# Altium schematic sheet Sheet_1_2024-01-05.schdoc
size 313 x 218 mm
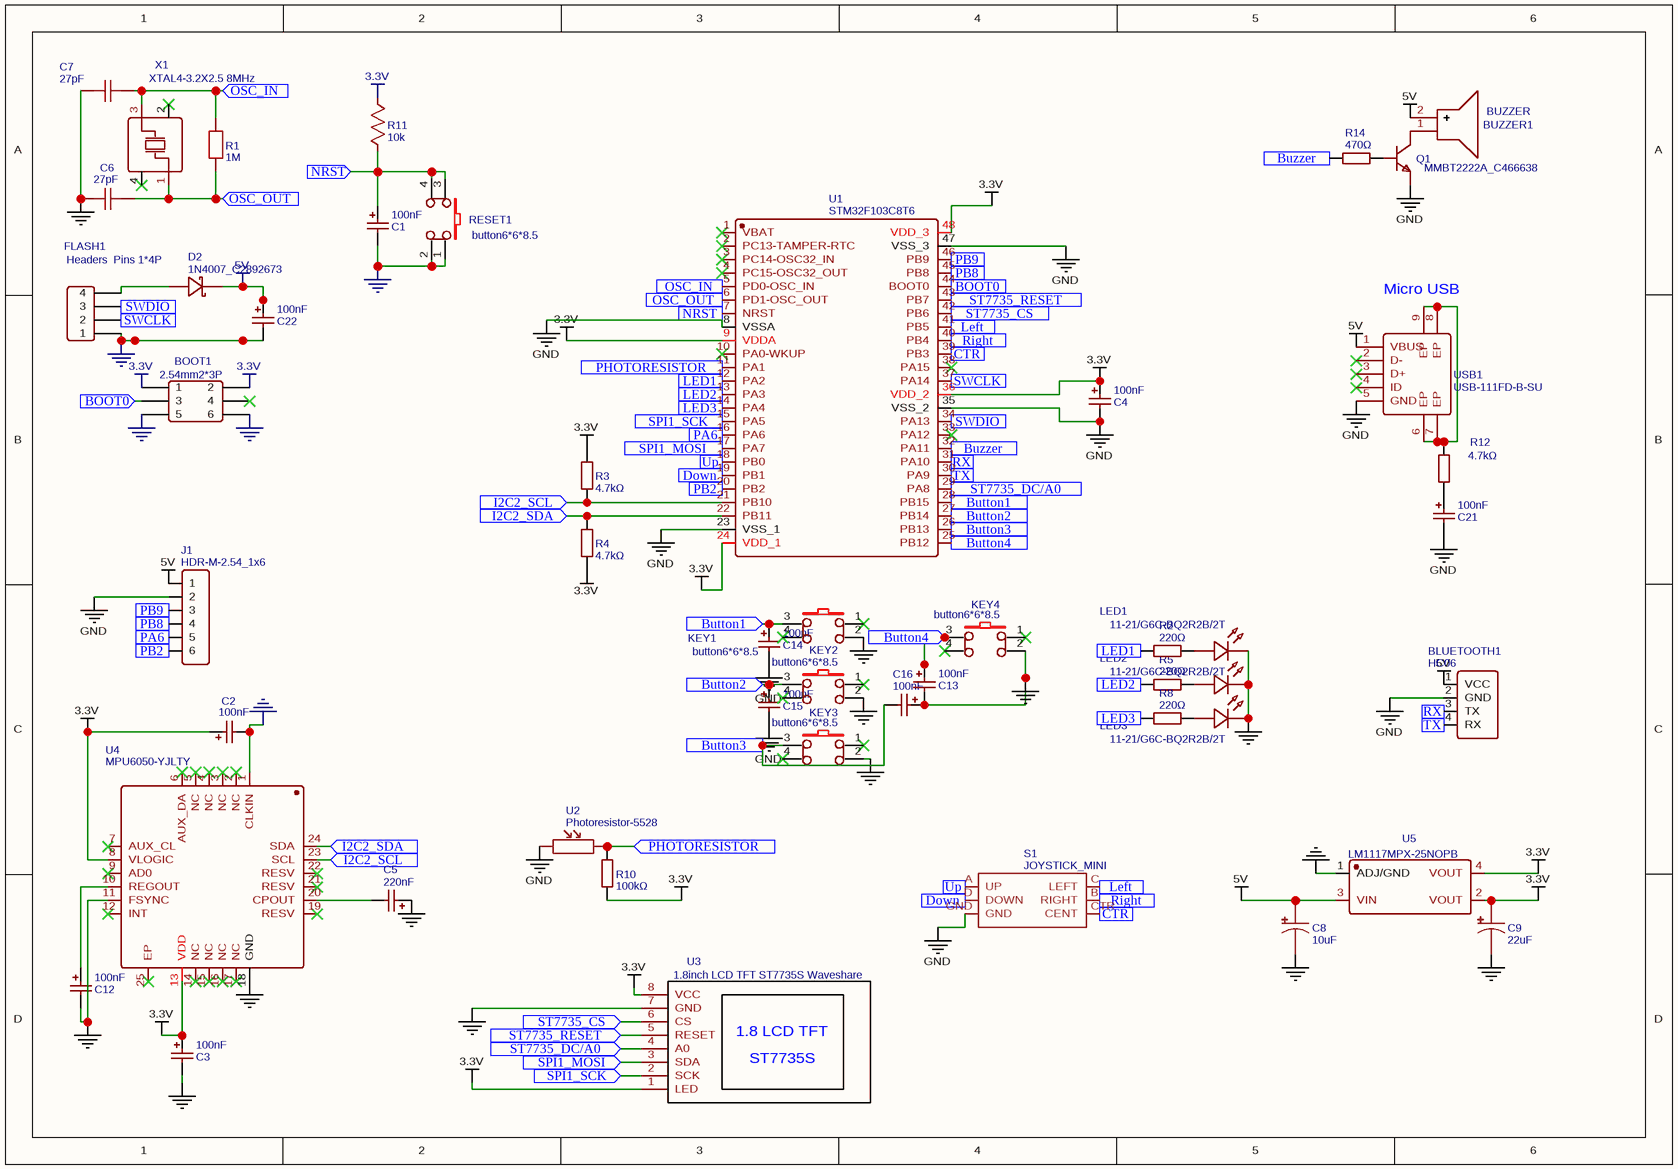
[diagram p0: Sheet_1_2024-01-05.schdoc]

## Parts
BLUETOOTH1  HC06  [HC06]
BOOT1  2.54mm2*3P  [HDR-3X2/2.54]
BUZZER1  BUZZER  [BUZ-TH_BD12.0-P6.00-D0.9-RD]
C1  100nF  [C0402]
C2  100nF  [C0402]
C3  100nF  [C0402]
C4  100nF  [C0402]
C5  220nF  [C0402]
C6  27pF  [C0402]
C7  27pF  [C0402]
C8  10uF  [C0402]
C9  22uF  [C0402]
C12  100nF  [C0402]
C13  100nF  [C0402]
C14  100nF  [C0402]
C15  100nF  [C0402]
C16  100nF  [C0402]
C21  100nF  [C0402]
C22  100nF  [C0402]
D2  1N4007_C2892673  [SMA_L4.3-W2.6-LS5.1-R-RD]
FLASH1  Headers  Pins 1*4P  [HDR-4X1/2.54]
J1  HDR-M-2.54_1x6  [HDR-M-2.54_1X6]
KEY1  button6*6*8.5  [KEY-TH_4P-L6.0-W6.0-P4.50]
KEY2  button6*6*8.5  [KEY-TH_4P-L6.0-W6.0-P4.50]
KEY3  button6*6*8.5  [KEY-TH_4P-L6.0-W6.0-P4.50]
KEY4  button6*6*8.5  [KEY-TH_4P-L6.0-W6.0-P4.50]
LED1  11-21/G6C-BQ2R2B/2T  [LED1206-RD]
LED2  11-21/G6C-BQ2R2B/2T  [LED1206-RD]
LED3  11-21/G6C-BQ2R2B/2T  [LED1206-RD]
Q1  MMBT2222A_C466638  [SOT-23-3_L2.9-W1.4-P1.90-LS2.6-BR]
R1  1M  [R0603]
R2  220Ω  [R1206]
R3  4.7kΩ  [R1206]
R4  4.7kΩ  [R1206]
R5  220Ω  [R1206]
R8  220Ω  [R1206]
R10  100kΩ  [R1206]
R11  10k  [1206]
R12  4.7kΩ  [R1206]
R14  470Ω  [R1206]
RESET1  button6*6*8.5  [KEY-TH_4P-L6.0-W6.0-P4.50]
S1  JOYSTICK_MINI  [JOYSTICK_MINI]
U1  STM32F103C8T6  [LQFP-48_L7.0-W7.0-P0.50-LS9.0-BL]
U2  Photoresistor-5528  [SNR2-3.0]
U3  1.8inch LCD TFT ST7735S Waveshare  [1.8 LCD TFT ST7735S WAVESHARE]
U4  MPU6050-YJLTY  [QFN-24_L4.0-W4.0-P0.50-BL-EP2.7]
U5  LM1117MPX-25NOPB  [SOT-223_L6.5-W3.5-P2.30-LS7.0-BR]
USB1  USB-111FD-B-SU  [USB-SMD_USB-111FD-B-SU]
X1  XTAL4-3.2X2.5 8MHz  [CRYSTAL-SMD_4P-L3.2-W2.5-BL]

## Ports
BOOT0 (in), Button1 (in), Button2 (in), Button3 (in), Button4 (in), Buzzer (in), CTR (in), Down (in), I2C2_SCL (in), I2C2_SDA (in), LED1 (in), LED2 (in), LED3 (in), Left (in), NRST (in), OSC_IN (in), OSC_OUT (in), PA6 (in), PB2 (in), PB8 (in), PB9 (in), PHOTORESISTOR (in), Right (in), RX (in), SPI1_MOSI (in), SPI1_SCK (in), ST7735_CS (in), ST7735_DC/A0 (in), ST7735_RESET (in), SWCLK (in), SWDIO (in), TX (in), Up (in)

## Nets
3.3V: BOOT1.1 BOOT1.2 C2.1 C3.1 C4.1 C9.1 R3.2 R4.2 R10.1 R11.2 U1.9(VDDA) U1.24(VDD_1) U1.36(VDD_2) U1.48(VDD_3) U3.1(LED) U3.8(VCC) U4.8(VLOGIC) U4.13(VDD) U5.2(VOUT) U5.4(VOUT)
5V: BLUETOOTH1.1(VCC) BUZZER1.2(+) C8.1 C22.1 D2.2(K) J1.1 U5.3(VIN) USB1.1(VBUS)
GND: BLUETOOTH1.2(GND) BOOT1.5 BOOT1.6 C1.2 C2.2 C3.2 C4.2 C5.1 C6.1 C7.1 C8.2 C9.2 C12.2 C13.2 C14.2 C15.2 C16.1 C21.2 C22.2 FLASH1.1 J1.2 KEY1.2 KEY2.2 KEY3.2 KEY4.2 LED1.1(K) LED2.1(K) LED3.1(K) Q1.2(E) RESET1.1 RESET1.2 S1.GND U1.8(VSSA) U1.23(VSS_1) U1.35(VSS_2) U1.47(VSS_3) U2.1(P$1) U3.7(GND) U4.1(CLKIN) U4.11(FSYNC) U4.18(GND) U5.1(ADJ/GND) USB1.5(GND)
BOOT0: BOOT1.3 U1.44(BOOT0) ; port BOOT0
Button1: C14.1 KEY1.3 U1.28(PB15) ; port Button1
Button2: C15.1 KEY2.3 U1.27(PB14) ; port Button2
Button3: C16.2 KEY3.3 U1.26(PB13) ; port Button3
Button4: C13.1 KEY4.3 U1.25(PB12) ; port Button4
Buzzer: R14.2 U1.32(PA11) ; port Buzzer
CTR: S1.CTR(CENT) U1.39(PB3) ; port CTR
Down: S1.D(DOWN) U1.19(PB1) ; port Down
I2C2_SCL: R3.1 U1.21(PB10) U4.23(SCL) ; port I2C2_SCL
I2C2_SDA: R4.1 U1.22(PB11) U4.24(SDA) ; port I2C2_SDA
LED1: R2.1 U1.12(PA2) ; port LED1
LED2: R5.1 U1.13(PA3) ; port LED2
LED3: R8.1 U1.14(PA4) ; port LED3
Left: S1.C(LEFT) U1.41(PB5) ; port Left
NRST: C1.1 R11.1 RESET1.3 RESET1.4 U1.7(NRST) ; port NRST
OSC_IN: C7.2 R1.1 U1.5(PD0-OSC_IN) X1.3(OSC2) ; port OSC_IN
OSC_OUT: C6.2 R1.2 U1.6(PD1-OSC_OUT) X1.1(OSC1) ; port OSC_OUT
PA6: J1.5 U1.16(PA6) ; port PA6
PB2: J1.6 U1.20(PB2) ; port PB2
PB8: J1.4 U1.45(PB8) ; port PB8
PB9: J1.3 U1.46(PB9) ; port PB9
PHOTORESISTOR: R10.2 U1.11(PA1) U2.2(P$2) ; port PHOTORESISTOR
Right: S1.B(RIGHT) U1.40(PB4) ; port Right
RX: BLUETOOTH1.3(TX) U1.31(PA10) ; port RX
SPI1_MOSI: U1.17(PA7) U3.3(SDA) ; port SPI1_MOSI
SPI1_SCK: U1.15(PA5) U3.2(SCK) ; port SPI1_SCK
ST7735_CS: U1.42(PB6) U3.6(CS) ; port ST7735_CS
ST7735_DC/A0: U1.29(PA8) U3.4(A0) ; port ST7735_DC/A0
ST7735_RESET: U1.43(PB7) U3.5(RESET) ; port ST7735_RESET
SWCLK: FLASH1.2 U1.37(PA14) ; port SWCLK
SWDIO: FLASH1.3 U1.34(PA13) ; port SWDIO
TX: BLUETOOTH1.4(RX) U1.30(PA9) ; port TX
Up: S1.A(UP) U1.18(PB0) ; port Up
NetBUZZER1_1: BUZZER1.1(-) Q1.3(C)
NetC5_2: C5.2 U4.20(CPOUT)
NetC12_1: C12.1 U4.10(REGOUT)
NetC21_1: C21.1 R12.2
NetD2_1: D2.1(A) FLASH1.4
NetLED1_2: LED1.2(A) R2.2
NetLED2_2: LED2.2(A) R5.2
NetLED3_2: LED3.2(A) R8.2
NetQ1_1: Q1.1(B) R14.1
NetR12_1: R12.1 USB1.6(EP) USB1.7(EP) USB1.8(EP) USB1.9(EP)

Not connected (* = marked no-connect by the designer): BOOT1 4*; KEY1 1* 4*; KEY2 1* 4*; KEY3 1* 4*; KEY4 1* 4*; U1 1(VBAT)* 2(PC13-TAMPER-RTC)* 3(PC14-OSC32_IN)* 4(PC15-OSC32_OUT)* 10(PA0-WKUP)* 33(PA12)* 38(PA15)*; U4 2(NC)* 3(NC)* 4(NC)* 5(NC)* 6(AUX_DA)* 7(AUX_CL)* 9(AD0)* 12(INT)* 14(NC)* 15(NC)* 16(NC)* 17(NC)* 19(RESV)* 21(RESV)* 22(RESV)* 25(EP)*; USB1 2(D-)* 3(D+)* 4(ID)*; X1 2* 4*

## Notes on the sheet
- (near USB1) Micro USB
- (in symbol 1.8inch LCD TFT ST7735S Waveshare) 1.8 LCD TFT; ST7735S

## Library data of the parts
BLUETOOTH1 = HC06: Contributor: Zelevar; timeStamp: 1473620610; BOM_Supplier: LCSC; spicePre: B; spiceSymbolName: HC06
BOOT1 = 2.54mm2*3P: BOM_Manufacturer: BOOMELE; BOM_Manufacturer Part: 2.54mm2*3P直排针袋装环保; BOM_Supplier: LCSC; spicePre: P; BOM_Supplier Part: C65114
BUZZER1 = BUZZER: BOM_Manufacturer: null; Contributor: lcsc; BOM_Supplier: LCSC; BOM_Supplier Part: C9900014030; BOM_Manufacturer Part: buzzer; BOM_JLCPCB Part Class: Extended Part; spicePre: B; spiceSymbolName: BUZZER
C1-C4 C12-C16 C21 C22 = 100nF: BOM_Manufacturer: Kyocera AVX; BOM_Manufacturer Part: TAJA104K035RNJ; nameAlias: Capacitance; BOM_Supplier: LCSC; BOM_Supplier Part: C7173; BOM_JLCPCB Part Class: Extended Part; spicePre: C; spiceSymbolName: TAJA104K035RNJ
C5 = 220nF: BOM_Manufacturer: Kyocera AVX; BOM_Manufacturer Part: TAJA224K035RNJ; nameAlias: Capacitance; BOM_Supplier: LCSC; BOM_Supplier Part: C11364; BOM_JLCPCB Part Class: Extended Part; spicePre: C; spiceSymbolName: TAJA224K035RNJ
C6 C7 = 27pF: nameAlias: Value(F); Contributor: LCEDA_Lib; spicePre: C; spiceSymbolName: C_0402_US
C8 = 10uF: BOM_Manufacturer: Changzhou Huawei Elec; BOM_Manufacturer Part: VT1H0R1MB054000CE0; nameAlias: Capacitance; Contributor: LCSC; BOM_Supplier: LCSC; BOM_Supplier Part: C271438; BOM_JLCPCB Part Class: Extended Part; spicePre: C; spiceSymbolName: VT1H0R1MB054000CE0
C9 = 22uF: BOM_Manufacturer: Changzhou Huawei Elec; BOM_Manufacturer Part: VT1H0R1MB054000CE0; nameAlias: Capacitance; Contributor: LCSC; BOM_Supplier: LCSC; BOM_Supplier Part: C271438; BOM_JLCPCB Part Class: Extended Part; spicePre: C; spiceSymbolName: VT1H0R1MB054000CE0
D2 = 1N4007_C2892673: BOM_Manufacturer: YONGYUTAI(永裕泰); BOM_Manufacturer Part: 1N4007; Contributor: LCSC; BOM_Supplier: LCSC; BOM_Supplier Part: C2892673; BOM_JLCPCB Part Class: Extended Part; spicePre: D; spiceSymbolName: 1N4007_C2892673
FLASH1 = Headers  Pins 1*4P: BOM_Manufacturer: ReliaPro; BOM_Supplier: LCSC; BOM_Manufacturer Part: Headers  Pins 1*4P; image: http://image.lceda.cn/szlcsc/C59481.jpg; spicePre: P
J1 = HDR-M-2.54_1x6: Contributor: LCEDA_Lib; BOM_Supplier Part: C190819; BOM_Supplier: LCSC; spicePre: J; spiceSymbolName: HDR-M-2.54_1x6
KEY1-KEY4 RESET1 = button6*6*8.5: BOM_Manufacturer: ReliaPro; BOM_Supplier Part: C59980; BOM_Supplier: LCSC; BOM_Manufacturer Part: button6*6*8.5; spicePre: K; spiceSymbolName: button6*6*8.5
LED1-LED3 = 11-21/G6C-BQ2R2B/2T: BOM_Manufacturer: null; Contributor: lcsc; BOM_Supplier: LCSC; BOM_Supplier Part: C9900016674; BOM_Manufacturer Part: 11-21/G6C-BQ2R2B/2T; link: https://atta.szlcsc.comnull; BOM_JLCPCB Part Class: Extended Part; spicePre: L; spiceSymbolName: 11-21/G6C-BQ2R2B/2T
Q1 = MMBT2222A_C466638: BOM_Manufacturer: High Diode(海德); Contributor: LCSC; BOM_Supplier: LCSC; BOM_Supplier Part: C466638; BOM_Manufacturer Part: MMBT2222A; BOM_JLCPCB Part Class: Extended Part; spicePre: Q; spiceSymbolName: MMBT2222A_C466638
R1 = 1M: nameAlias: Value(Ω); Contributor: LCEDA_Lib; spicePre: R; spiceSymbolName: R_0603_EU
R2 R5 R8 = 220Ω: BOM_Manufacturer: RALEC(旺诠); BOM_Manufacturer Part: RTT06472JTP; nameAlias: Resistance; Resistance (Ohms): 4.7K; BOM_Supplier: LCSC; BOM_Supplier Part: C104821; BOM_JLCPCB Part Class: Extended Part; spicePre: R; spiceSymbolName: RTT06472JTP
R3 R4 R12 = 4.7kΩ: BOM_Manufacturer: RALEC(旺诠); BOM_Manufacturer Part: RTT06472JTP; nameAlias: Resistance; Resistance (Ohms): 4.7K; BOM_Supplier: LCSC; BOM_Supplier Part: C104821; BOM_JLCPCB Part Class: Extended Part; spicePre: R; spiceSymbolName: RTT06472JTP
R10 = 100kΩ: BOM_Manufacturer: RALEC(旺诠); BOM_Manufacturer Part: RTT06472JTP; nameAlias: Resistance; Resistance (Ohms): 4.7K; BOM_Supplier: LCSC; BOM_Supplier Part: C104821; BOM_JLCPCB Part Class: Extended Part; spicePre: R; spiceSymbolName: RTT06472JTP
R11 = 10k: nameAlias: Value(Ω); BOM_Manufacturer Part: ?; spicePre: R; spiceSymbolName: Res_1206(1/4W)_US
R14 = 470Ω: BOM_Manufacturer: RALEC(旺诠); BOM_Manufacturer Part: RTT06472JTP; nameAlias: Resistance; Resistance (Ohms): 4.7K; BOM_Supplier: LCSC; BOM_Supplier Part: C104821; BOM_JLCPCB Part Class: Extended Part; spicePre: R; spiceSymbolName: RTT06472JTP
S1 = JOYSTICK_MINI: description: Small 5-way tactile joystick, COM-10063; Contributor: SparkFun; spicePre: S; spiceSymbolName: JOYSTICK_MINI
U1 = STM32F103C8T6: BOM_Manufacturer: ST(意法半导体); timeStamp: 1455028086; BOM_Supplier: LCSC; BOM_Manufacturer Part: STM32F103C8T6; BOM_Supplier Part: C8734; BOM_JLCPCB Part Class: Basic Part; spicePre: U; spiceSymbolName: STM32F103C8T6
U2 = Photoresistor-5528: description: DIP RES Photoresistor 10K;2P-3.0; BOM_Manufacturer Part: Photoresistor-5528; spicePre: U; spiceSymbolName: Photoresistor-5528
U3 = 1.8inch LCD TFT ST7735S Waveshare: Contributor: MichalKos; spicePre: U; spiceSymbolName: 1.8inch LCD TFT ST7735S Waveshare
U4 = MPU6050-YJLTY: BOM_Manufacturer: null; Contributor: LCSC; BOM_Supplier: LCSC; BOM_Supplier Part: C2912107; BOM_Manufacturer Part: MPU6050-YJLTY; BOM_JLCPCB Part Class: Extended Part; spicePre: U; spiceSymbolName: MPU6050-YJLTY
U5 = LM1117MPX-25NOPB: BOM_Manufacturer: onsemi(安森美); Contributor: LCSC; BOM_Supplier: LCSC; BOM_Supplier Part: C2902257; BOM_Manufacturer Part: LM1117MPX-25NOPB; BOM_JLCPCB Part Class: Extended Part; spicePre: U; spiceSymbolName: LM1117MPX-25NOPB
USB1 = USB-111FD-B-SU: BOM_Manufacturer: HOOYA(香港皓宇); BOM_Manufacturer Part: USB-111FD-B-SU B型; Contributor: lcsc; BOM_Supplier: LCSC; BOM_Supplier Part: C2939564; BOM_JLCPCB Part Class: Extended Part; spicePre: U; spiceSymbolName: USB-111FD-B-SU
X1 = XTAL4-3.2X2.5 8MHz: BOM_Manufacturer: null; Contributor: LCSC; BOM_Supplier: LCSC; BOM_Supplier Part: C9900003449; BOM_Manufacturer Part: XTAL4-3.2X2.5; LINK: https://www.yxc.hk/uploadfiles/2021/11/YSX321SL.pdf; BOM_JLCPCB Part Class: Extended Part; spicePre: X; spiceSymbolName: XTAL4-3.2X2.5